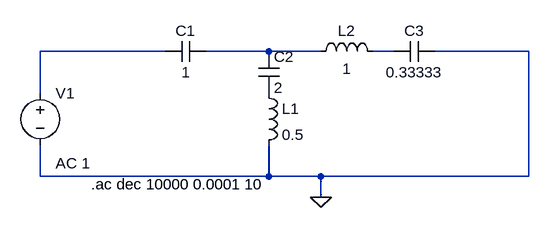
[diagram p0: schematic ej1.asc]
ej1.asc, the LTspice schematic file:
Version 4
SHEET 1 956 680
WIRE 16 160 -176 160
WIRE 176 160 80 160
WIRE 256 160 176 160
WIRE 368 160 336 160
WIRE 576 160 432 160
WIRE -176 224 -176 160
WIRE -176 352 -176 304
WIRE 176 352 176 304
WIRE 176 352 -176 352
WIRE 256 352 176 352
WIRE 576 352 576 160
WIRE 576 352 256 352
WIRE 256 384 256 352
FLAG 256 384 0
SYMBOL cap 80 144 R90
WINDOW 0 0 32 VBottom 2
WINDOW 3 32 32 VTop 2
SYMATTR InstName C1
SYMATTR Value 1
SYMBOL ind 160 208 R0
SYMATTR InstName L1
SYMATTR Value 0.5
SYMBOL cap 160 160 R0
SYMATTR InstName C2
SYMATTR Value 2
SYMBOL ind 240 176 R270
WINDOW 0 32 56 VTop 2
WINDOW 3 5 56 VBottom 2
SYMATTR InstName L2
SYMATTR Value 1
SYMBOL cap 432 144 R90
WINDOW 0 0 32 VBottom 2
WINDOW 3 32 32 VTop 2
SYMATTR InstName C3
SYMATTR Value 0.33333
SYMBOL voltage -176 208 R0
WINDOW 123 24 124 Left 2
WINDOW 39 0 0 Left 0
SYMATTR InstName V1
SYMATTR Value ""
SYMATTR Value2 AC 1
TEXT -98 364 Left 2 !.ac dec 10000 0.0001 10

The netlist it stands for:
* ej1.asc
C1 N002 N001 1
L1 P001 0 0.5
C2 N002 P001 2
L2 N002 N003 1
C3 0 N003 0.33333
V1 N001 0 AC 1
.ac dec 10000 0.0001 10
.backanno
.end